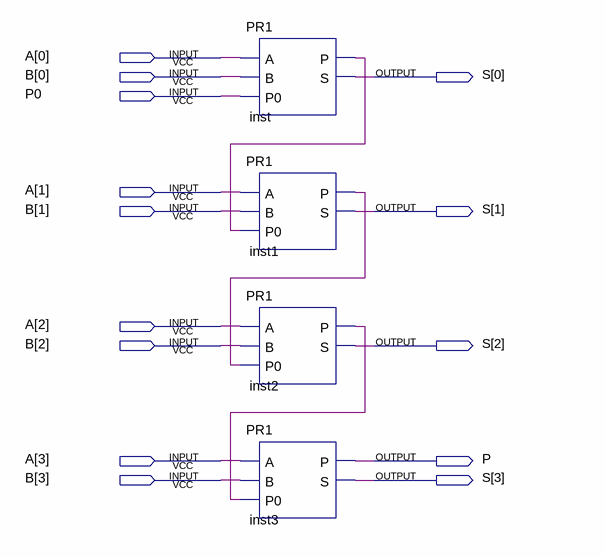
[diagram p0: schematic sheet]
// Quartus schematic LR2.bdf as structural Verilog: 4 symbols, 14 pins
module LR2 (
  input  [3:0] A,
  input  [3:0] B,
  input  P0,
  output [3:0] S,
  output P
);

  wire inst1_p, inst2_p, inst_p;

  PR1 inst (.A(A[0]), .B(B[0]), .P0(P0), .P(inst_p), .S(S[0]));
  PR1 inst1 (.A(A[1]), .B(B[1]), .P0(inst_p), .P(inst1_p), .S(S[1]));
  PR1 inst2 (.A(A[2]), .B(B[2]), .P0(inst1_p), .P(inst2_p), .S(S[2]));
  PR1 inst3 (.A(A[3]), .B(B[3]), .P0(inst2_p), .P(P), .S(S[3]));
endmodule
